# EAGLE schematic P3-Medidor_Baterias (EAGLE 9.6.2)
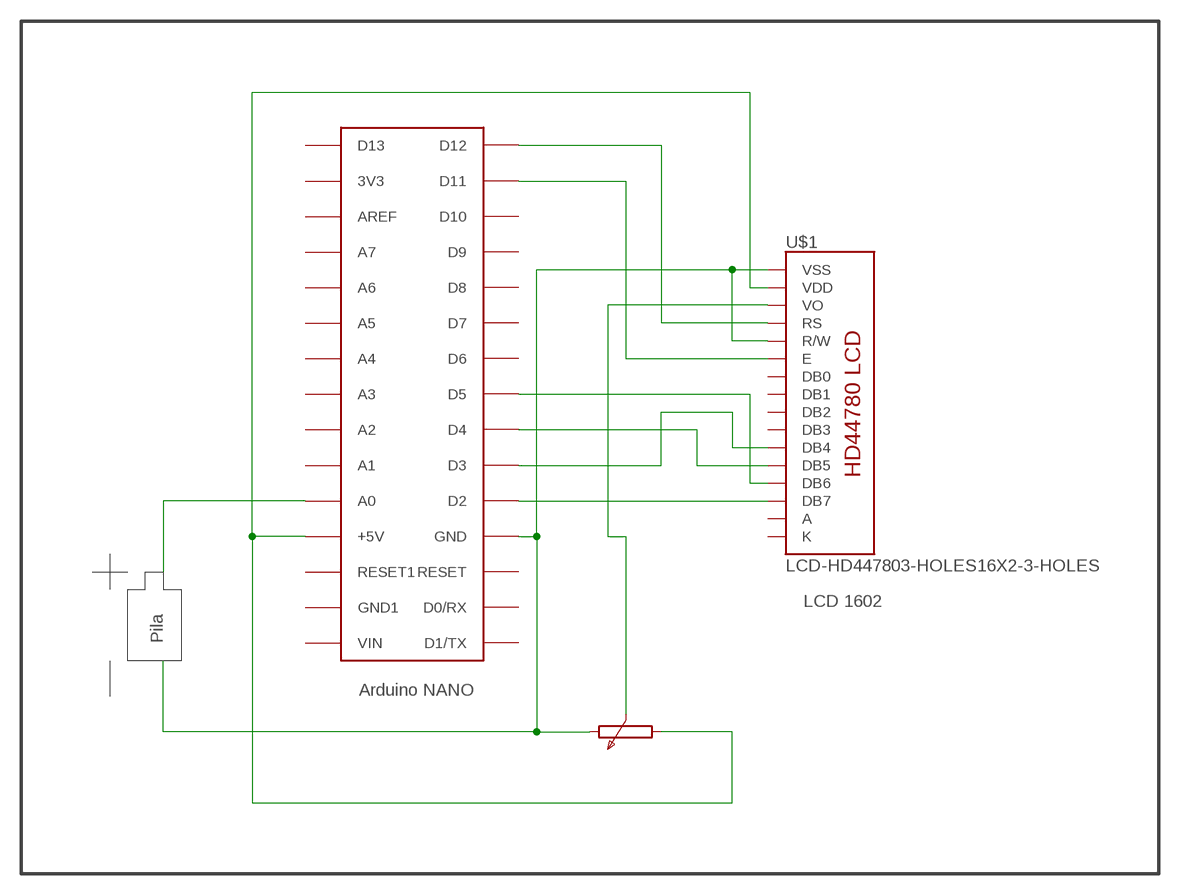
[diagram p0: schematic, sheet 1]

## Parts
U$1  LCD-HD447803-HOLES16X2-3-HOLES  [LCD-16X2-3HOLES]
U$2  ARDUINONANO  [PDIP-32]

## Nets
N$1: U$1.14(DB7) U$2.D2
N$2: U$1.13(DB6) U$2.D5
N$3: U$1.12(DB5) U$2.D4
N$4: U$1.11(DB4) U$2.D3
N$5: U$1.6(E) U$2.D11
N$6: U$1.4(RS) U$2.D12
N$7: U$1.1(VSS) U$1.5(R/W) U$2.GND
N$8: U$1.2(VDD) U$2.+5V
N$9: U$1.3(VO)
N$10: U$2.A0
Unconnected: U$1.7(DB0) U$1.8(DB1) U$1.9(DB2) U$1.10(DB3) U$2.3V3 U$2.A1 U$2.A2 U$2.A3 U$2.A4 U$2.A5 U$2.A6 U$2.A7 U$2.AREF U$2.D0/RX U$2.D1/TX U$2.D6 U$2.D7 U$2.D8 U$2.D9 U$2.D10 U$2.D13 U$2.GND1 U$2.RESET U$2.RESET1 U$2.VIN

## Notes on the sheet
- LCD 1602
- Pila
- Arduino NANO

## Power pins joined to a net without a drawn wire
A: U$1.15(A)
K: U$1.16(K)

## Library data of the parts
U$1 = HD44780LCD:LCD-HD44780
U$2 = jet-lib:ARDUINONANO